# EAGLE design R131C (EAGLE 6.6.0)
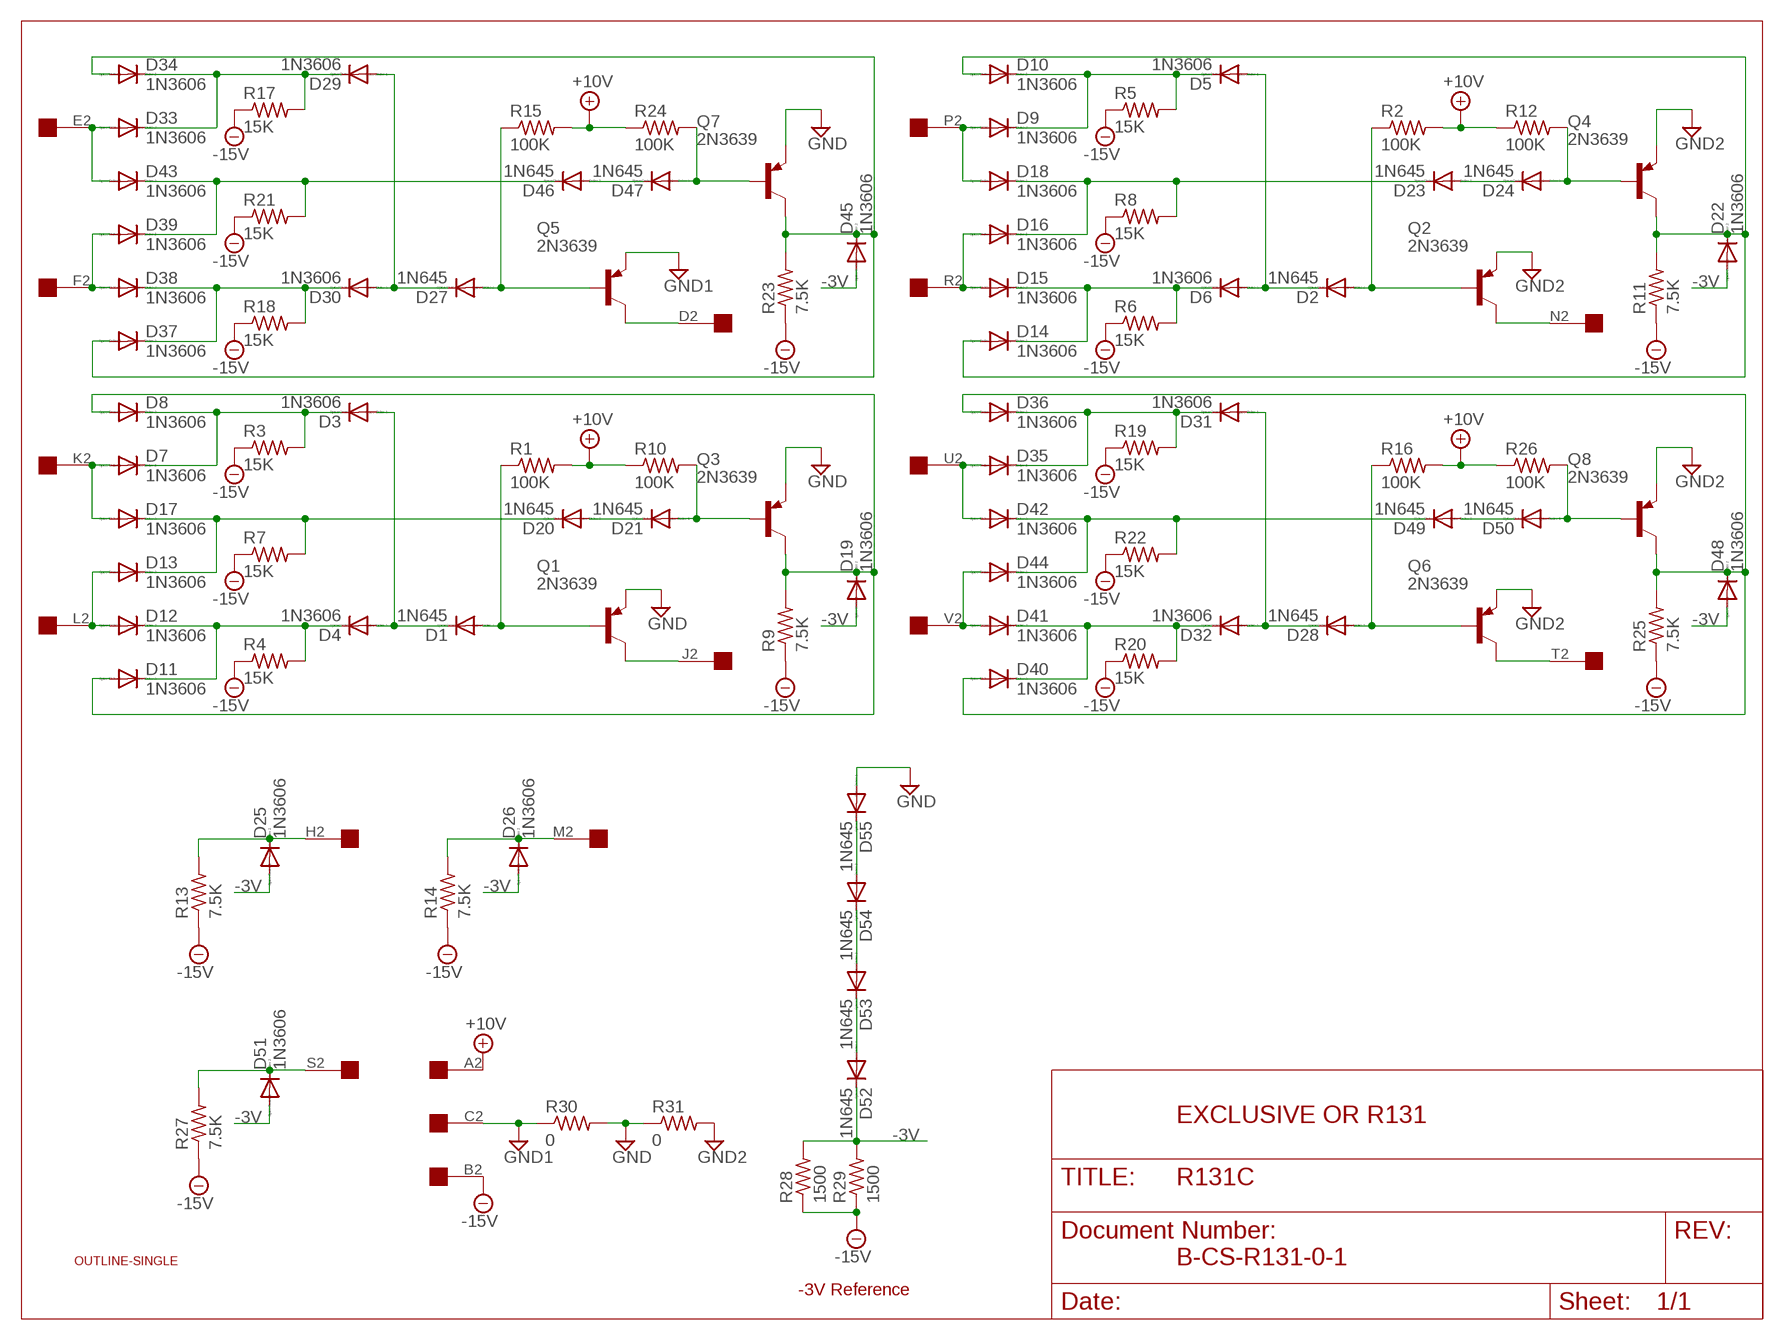
[diagram p0: schematic, sheet 1]

## Parts
D1  1N645  1N4148DO35-10  [DO35-10]
D2  1N645  1N4148DO35-10  [DO35-10]
D3  1N3606  1N4148DO35-10  [DO35-10]
D4  1N3606  1N4148DO35-10  [DO35-10]
D5  1N3606  1N4148DO35-10  [DO35-10]
D6  1N3606  1N4148DO35-10  [DO35-10]
D7  1N3606  1N4148DO35-10  [DO35-10]
D8  1N3606  1N4148DO35-10  [DO35-10]
D9  1N3606  1N4148DO35-10  [DO35-10]
D10  1N3606  1N4148DO35-10  [DO35-10]
D11  1N3606  1N4148DO35-10  [DO35-10]
D12  1N3606  1N4148DO35-10  [DO35-10]
D13  1N3606  1N4148DO35-10  [DO35-10]
D14  1N3606  1N4148DO35-10  [DO35-10]
D15  1N3606  1N4148DO35-10  [DO35-10]
D16  1N3606  1N4148DO35-10  [DO35-10]
D17  1N3606  1N4148DO35-10  [DO35-10]
D18  1N3606  1N4148DO35-10  [DO35-10]
D19  1N3606  1N4148DO35-10  [DO35-10]
D20  1N645  1N4148DO35-10  [DO35-10]
D21  1N645  1N4148DO35-10  [DO35-10]
D22  1N3606  1N4148DO35-10  [DO35-10]
D23  1N645  1N4148DO35-10  [DO35-10]
D24  1N645  1N4148DO35-10  [DO35-10]
D25  1N3606  1N4148DO35-10  [DO35-10]
D26  1N3606  1N4148DO35-10  [DO35-10]
D27  1N645  1N4148DO35-10  [DO35-10]
D28  1N645  1N4148DO35-10  [DO35-10]
D29  1N3606  1N4148DO35-10  [DO35-10]
D30  1N3606  1N4148DO35-10  [DO35-10]
D31  1N3606  1N4148DO35-10  [DO35-10]
D32  1N3606  1N4148DO35-10  [DO35-10]
D33  1N3606  1N4148DO35-10  [DO35-10]
D34  1N3606  1N4148DO35-10  [DO35-10]
D35  1N3606  1N4148DO35-10  [DO35-10]
D36  1N3606  1N4148DO35-10  [DO35-10]
D37  1N3606  1N4148DO35-10  [DO35-10]
D38  1N3606  1N4148DO35-10  [DO35-10]
D39  1N3606  1N4148DO35-10  [DO35-10]
D40  1N3606  1N4148DO35-10  [DO35-10]
D41  1N3606  1N4148DO35-10  [DO35-10]
D42  1N3606  1N4148DO35-10  [DO35-10]
D43  1N3606  1N4148DO35-10  [DO35-10]
D44  1N3606  1N4148DO35-10  [DO35-10]
D45  1N3606  1N4148DO35-10  [DO35-10]
D46  1N645  1N4148DO35-10  [DO35-10]
D47  1N645  1N4148DO35-10  [DO35-10]
D48  1N3606  1N4148DO35-10  [DO35-10]
D49  1N645  1N4148DO35-10  [DO35-10]
D50  1N645  1N4148DO35-10  [DO35-10]
D51  1N3606  1N4148DO35-10  [DO35-10]
D52  1N645  1N4148DO35-10  [DO35-10]
D53  1N645  1N4148DO35-10  [DO35-10]
D54  1N645  1N4148DO35-10  [DO35-10]
D55  1N645  1N4148DO35-10  [DO35-10]
Q1  2N3639  2N3637  [TO39]
Q2  2N3639  2N3637  [TO39]
Q3  2N3639  2N3637  [TO39]
Q4  2N3639  2N3637  [TO39]
Q5  2N3639  2N3637  [TO39]
Q6  2N3639  2N3637  [TO39]
Q7  2N3639  2N3637  [TO39]
Q8  2N3639  2N3637  [TO39]
R1  100K  R-US_0207/10  [0207/10]
R2  100K  R-US_0207/10  [0207/10]
R3  15K  R-US_0207/10  [0207/10]
R4  15K  R-US_0207/10  [0207/10]
R5  15K  R-US_0207/10  [0207/10]
R6  15K  R-US_0207/10  [0207/10]
R7  15K  R-US_0207/10  [0207/10]
R8  15K  R-US_0207/10  [0207/10]
R9  7.5K  R-US_0207/10  [0207/10]
R10  100K  R-US_0207/10  [0207/10]
R11  7.5K  R-US_0207/10  [0207/10]
R12  100K  R-US_0207/10  [0207/10]
R13  7.5K  R-US_0207/10  [0207/10]
R14  7.5K  R-US_0207/10  [0207/10]
R15  100K  R-US_0207/10  [0207/10]
R16  100K  R-US_0207/10  [0207/10]
R17  15K  R-US_0207/10  [0207/10]
R18  15K  R-US_0207/10  [0207/10]
R19  15K  R-US_0207/10  [0207/10]
R20  15K  R-US_0207/10  [0207/10]
R21  15K  R-US_0207/10  [0207/10]
R22  15K  R-US_0207/10  [0207/10]
R23  7.5K  R-US_0207/10  [0207/10]
R24  100K  R-US_0207/10  [0207/10]
R25  7.5K  R-US_0207/10  [0207/10]
R26  100K  R-US_0207/10  [0207/10]
R27  7.5K  R-US_0207/10  [0207/10]
R28  1500  R-US_0207/10  [0207/10]
R29  1500  R-US_0207/10  [0207/10]
R30  0  R-US_0207/10  [0207/10]
R31  0  R-US_0207/10  [0207/10]
U$1  OUTLINE-SINGLE  [SINGLE]
U$2  EDGE-1  [EDGE-CON1]

## Nets
+10V [Power]: R1.2 R2.2 R10.1 R12.1 R15.2 R16.2 R24.1 R26.1 U$2.A2
-3V [Power]: D19.A D22.A D25.A D26.A D45.A D48.A D51.A D52.C R28.2 R29.2
-15V [Power]: R3.1 R4.1 R5.1 R6.1 R7.1 R8.1 R9.1 R11.1 R13.1 R14.1 R17.1 R18.1 R19.1 R20.1 R21.1 R22.1 R23.1 R25.1 R27.1 R28.1 R29.1 U$2.B2
GND [Power]: D55.A Q1.1(E) Q3.1(E) Q7.1(E) R30.2 R31.1
GND1 [Power]: Q5.1(E) R30.1 U$2.C2
GND2: Q2.1(E) Q4.1(E) Q6.1(E) Q8.1(E) R31.2
N$1: D38.A D39.A U$2.F2
N$2: D4.C D11.C D12.C R4.2
N$3: D7.A D17.A U$2.K2
N$4: D29.C D33.C D34.C R17.2
N$5: D39.C D43.C D46.C R21.2
N$6: D30.C D37.C D38.C R18.2
N$7: D12.A D13.A U$2.L2
N$8: D3.C D7.C D8.C R3.2
N$9: D46.A D47.C
N$10: D13.C D17.C D20.C R7.2
N$11: D20.A D21.C
N$12: D21.A Q3.2(B) R10.2
N$13: D8.A D11.A D19.C Q3.3(C) R9.2
N$14: D1.C D3.A D4.A
N$15: D27.C D29.A D30.A
N$16: D47.A Q7.2(B) R24.2
N$17: D1.A Q1.2(B) R1.1
N$18: D34.A D37.A D45.C Q7.3(C) R23.2
N$19: Q1.3(C) U$2.J2
N$20: D33.A D43.A U$2.E2
N$21: D27.A Q5.2(B) R15.1
N$22: Q5.3(C) U$2.D2
N$23: D25.C R13.2 U$2.H2
N$24: D26.C R14.2 U$2.M2
N$25 [Power]: D52.A D53.C
N$26 [Power]: D53.A D54.C
N$27 [Power]: D54.A D55.C
N$28: D6.C D14.C D15.C R6.2
N$29: D9.A D18.A U$2.P2
N$30: D15.A D16.A U$2.R2
N$31: D5.C D9.C D10.C R5.2
N$32: D16.C D18.C D23.C R8.2
N$33: D23.A D24.C
N$34: D24.A Q4.2(B) R12.2
N$35: D10.A D14.A D22.C Q4.3(C) R11.2
N$36: D2.C D5.A D6.A
N$37: D2.A Q2.2(B) R2.1
N$38: Q2.3(C) U$2.N2
N$39: D32.C D40.C D41.C R20.2
N$40: D35.A D42.A U$2.U2
N$41: D41.A D44.A U$2.V2
N$42: D31.C D35.C D36.C R19.2
N$43: D42.C D44.C D49.C R22.2
N$44: D49.A D50.C
N$45: D50.A Q8.2(B) R26.2
N$46: D36.A D40.A D48.C Q8.3(C) R25.2
N$47: D28.C D31.A D32.A
N$48: D28.A Q6.2(B) R16.1
N$49: Q6.3(C) U$2.T2
N$50: D51.C R27.2 U$2.S2

## Notes on the sheet
- EXCLUSIVE OR R131
- B-CS-R131-0-1
- -3V Reference

## Library data of the parts
D1-D55 = diode:1N4148: DIODE high speed (Philips)
Q1-Q8 = transistor-pnp:2N3637*: PNP Transistror
R1-R31 = rcl:R-US_: RESISTOR, American symbol
U$1 = dec-con:OUTLINE-*: Board outlines for DEC boards.
U$2 = dec-con:EDGE-1: Single-Sided DEC Edge Connector -- (side 2)

## Net classes
1 Power: width 0.813 mm

## Board
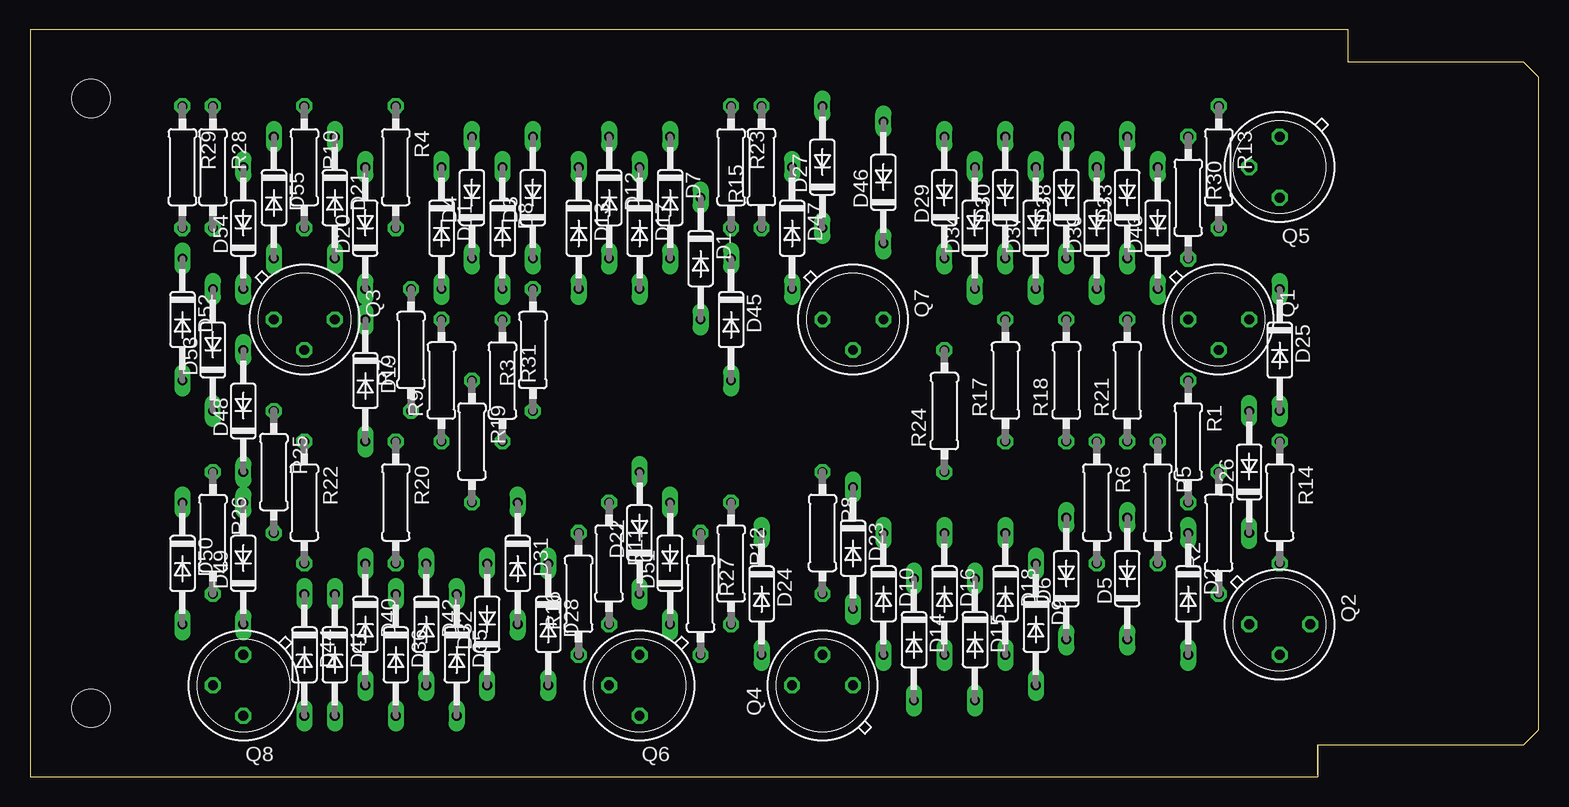
[diagram p1: board, top side]
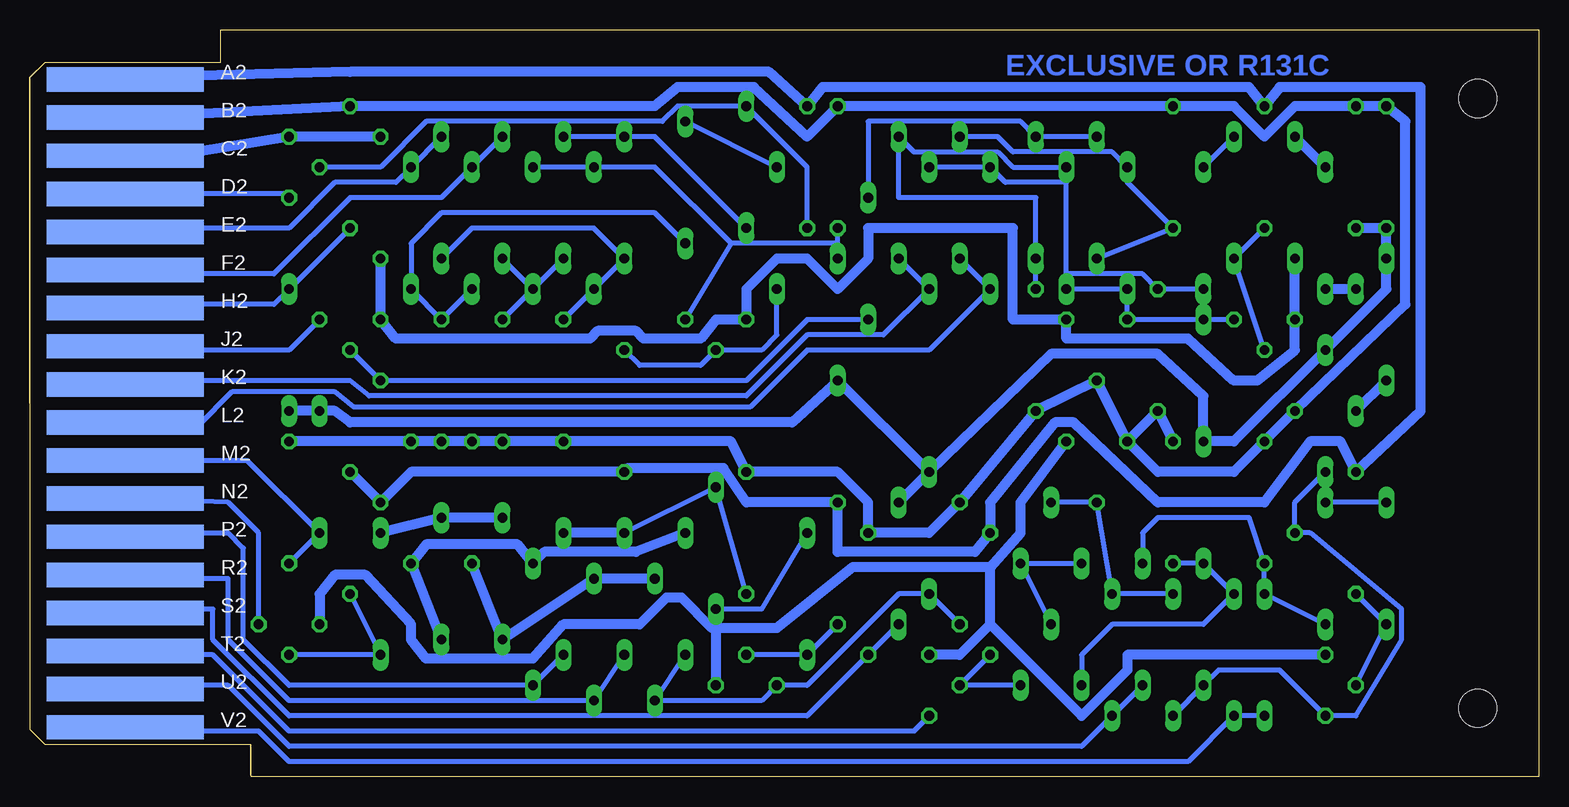
[diagram p2: board, bottom side, seen from below]

Size 125.73 x 62.23 mm. Coordinates in mm from the lower left corner, seen from the top.
Copper layers (1+16): Top 0.035mm / dielectric 1.5mm / Bottom 0.035mm
Design rules "16mils": minimum track width 16mil, minimum drill 32mil, track to track 15mil, track to pad 10mil, pad to pad 10mil, via to via 10mil, smd to smd 10mil, copper to edge 13mil, drill to drill 10mil, minimum pad ring 10mil, minimum via ring 8mil, stop-mask expansion 0mil, vias tented up to drill 0mil, thermal gap 10mil

### Footprints (pad centres in the part's own frame; a part is rotated, then mirrored left to right if it is on the bottom)
DO35-10 = drill 0.813 long: A 5.08,0; C -5.08,0
TO39 = drill 0.813 octagon: 1 0,-2.54; 2 2.54,0; 3 0,2.54
0207/10 = drill 0.813 octagon: 1 -5.08,0; 2 5.08,0
SINGLE = hole 3.175: 120.65,56.515; 120.65,5.715
EDGE-CON1 = smd 13.106 x 2.032 bottom: A2 7.938,4.128; B2 7.938,7.303; C2 7.938,10.477; D2 7.938,13.652; E2 7.938,16.828; F2 7.938,20.003; H2 7.938,23.177; J2 7.938,26.352; K2 7.938,29.527; L2 7.938,32.703; M2 7.938,35.877; N2 7.938,39.053; P2 7.938,42.227; R2 7.938,45.403; S2 7.938,48.578; T2 7.938,51.752; U2 7.938,54.928; V2 7.938,58.102

### Placement (x,y rotation side)
D1  55.88,43.18 270 top
D2  96.52,15.24 270 top
D3  41.91,48.26 90 top
D4  36.83,48.26 90 top
D5  91.44,16.51 90 top
D6  86.36,16.51 90 top
D7  53.34,48.26 270 top
D8  39.37,45.72 270 top
D9  83.82,12.7 270 top
D10  71.12,15.24 270 top
D11  34.29,45.72 270 top
D12  48.26,48.26 270 top
D13  45.72,45.72 270 top
D14  73.66,11.43 270 top
D15  78.74,11.43 270 top
D16  76.2,15.24 270 top
D17  50.8,45.72 270 top
D18  81.28,15.24 270 top
D19  27.94,33.02 270 top
D20  27.94,45.72 90 top
D21  25.4,48.26 270 top
D22  50.8,20.32 90 top
D23  68.58,19.05 270 top
D24  60.96,15.24 270 top
D25  104.14,35.56 270 top
D26  101.6,25.4 90 top
D27  66.04,50.8 90 top
D28  43.18,12.7 270 top
D29  76.2,48.26 90 top
D30  81.28,48.26 90 top
D31  40.64,17.78 270 top
D32  38.1,12.7 90 top
D33  91.44,48.26 90 top
D34  78.74,45.72 90 top
D35  35.56,10.16 270 top
D36  30.48,10.16 270 top
D37  83.82,45.72 90 top
D38  86.36,48.26 90 top
D39  88.9,45.72 90 top
D40  27.94,12.7 270 top
D41  25.4,10.16 270 top
D42  33.02,12.7 270 top
D43  93.98,45.72 90 top
D44  22.86,10.16 270 top
D45  58.42,38.1 270 top
D46  71.12,49.53 90 top
D47  63.5,45.72 270 top
D48  17.78,30.48 90 top
D49  17.78,17.78 90 top
D50  12.7,17.78 270 top
D51  53.34,17.78 90 top
D52  12.7,38.1 270 top
D53  15.24,35.56 90 top
D54  17.78,45.72 90 top
D55  20.32,48.26 270 top
Q1  99.06,38.1 270 top
Q2  104.14,12.7 270 top
Q3  22.86,38.1 270 top
Q4  66.04,7.62 90 top
Q5  104.14,50.8 180 top
Q6  50.8,7.62 180 top
Q7  68.58,38.1 270 top
Q8  17.78,7.62 180 top
R1  96.52,27.94 270 top
R2  99.06,20.32 90 top
R3  41.91,35.56 90 top
R4  30.48,50.8 270 top
R5  93.98,22.86 270 top
R6  88.9,22.86 270 top
R7  31.75,35.56 90 top
R8  66.04,20.32 270 top
R9  34.29,33.02 90 top
R10  22.86,50.8 270 top
R11  48.26,17.78 270 top
R12  58.42,17.78 270 top
R13  99.06,50.8 270 top
R14  104.14,22.86 270 top
R15  60.96,50.8 90 top
R16  45.72,15.24 90 top
R17  81.28,33.02 90 top
R18  86.36,33.02 90 top
R19  36.83,27.94 270 top
R20  30.48,22.86 270 top
R21  91.44,33.02 90 top
R22  22.86,22.86 270 top
R23  58.42,50.8 270 top
R24  76.2,30.48 90 top
R25  20.32,25.4 270 top
R26  15.24,20.32 270 top
R27  55.88,15.24 270 top
R28  15.24,50.8 270 top
R29  12.7,50.8 270 top
R30  96.52,48.26 270 top
R31  39.37,33.02 270 top
U$1  125.73,62.23 180 top
U$2  125.73,62.23 180 top

### Tracks (layer width: path | path; a pad name or v marks a point on that pad's centre or on a via)
+10V
  Bottom 0.813: U$2.A2 111.76,58.42 99.06,58.74 64.14,58.74 R15.2 59.69,57.47 24.13,57.47 R10.1 21.59,57.47 9.84,57.47 9.84,30.48 R26.1 16.51,27.94 19.05,27.94 22.86,22.86 31.75,22.86 38.73,29.53 40.32,29.53 45.72,22.86 R16.2 46.99,18.73 58.42,18.73 R12.1 66.04,22.86 67.94,25.72 75.88,25.72 R24.1 93.98,25.4 R1.2 R2.2
-3V
  Bottom 0.813: D25.A D26.A 100.33,30.48 99.06,29.53 62.23,29.53 D45.A D22.A | D22.A D51.A | R28.2 R29.2 D52.C 12.7,40.64 D48.A 25.4,27.94 D19.A 27.94,31.75 31.75,35.24 40.64,35.24 D22.A
-15V
  Bottom 0.813: U$2.B2 R13.1 73.66,55.88 71.75,57.47 65.41,57.47 60.96,53.34 R23.1 R4.1 25.4,55.88 22.86,53.34 20.32,55.88 R28.1 R29.1 11.11,54.61 11.11,39.37 R25.1 R22.1 25.4,25.4 31.75,25.4 R9.1 | R14.1 R5.1 R21.1 R6.1 R18.1 R17.1 67.31,27.94 R8.1 58.42,25.4 55.88,22.86 R27.1 50.8,20.32 R11.1 R3.1 R19.1 R9.1 | R9.1 R7.1 R20.1
GND
  Bottom 0.813: R30.2 Q1.1 95.25,36.51 79.06,36.51 78.42,37.15 75.25,37.15 74.61,36.51 69.85,36.51 68.58,38.1 Q7.1 66.04,40.64 63.5,43.18 60.96,43.18 58.42,40.64 55.88,43.18 55.88,45.72 43.81,45.72 43.81,38.1 R31.1 39.37,36.51 29.21,36.51 25.4,33.02 23.5,33.02 20.32,35.56 Q3.1 D55.A
GND1
  Bottom 0.813: U$2.C2 111.76,52.07 Q5.1 R30.1
GND2
  Bottom 0.813: Q8.1 34.29,10.16 34.29,8.89 38.1,5.08 45.72,12.7 | 45.72,12.7 48.26,10.16 Q6.1 | 45.72,12.7 45.72,17.46 | 45.72,17.46 43.18,20.32 43.18,22.86 R31.2 | 68.58,12.38 Q4.1 | 68.58,12.38 63.5,12.38 57.15,17.46 45.72,17.46 | 68.58,12.38 68.9,12.38 71.44,14.92 72.71,14.92 74.93,12.7 81.28,12.7 83.82,9.84 92.71,9.84 93.98,11.43 93.98,12.7 97.79,16.83 100.33,16.83 101.6,15.24 Q2.1
N$1
  Bottom 0.406: D38.A D39.A 91.44,48.26 99.06,48.26 105.41,41.91 111.76,41.91 112.04,42.19 U$2.F2
N$2
  Bottom 0.406: D4.C R4.2 34.29,49.53 D11.C 35.56,52.07 43.81,52.07 45.09,53.34 D12.C
N$3
  Bottom 0.406: D7.A D17.A 54.61,36.83 60.96,36.83 66.04,31.75 97.47,31.75 99.06,33.02 116.84,33.02 117.14,32.72 U$2.K2
N$4
  Bottom 0.406: R17.2 D34.C D29.C 78.74,45.72 88.9,45.72 D33.C
N$5
  Bottom 0.406: D39.C R21.2 D43.C 93.98,44.45 91.44,46.99 73.66,46.99 D46.C
N$6
  Bottom 0.406: D37.C D30.C | D37.C R18.2 | D37.C D38.C
N$7
  Bottom 0.406: D12.A D13.A 50.8,35.56 60.96,35.56 65.72,30.8 98.74,30.8 100.33,32.07 108.9,32.07 111.76,29.21 116.84,29.21 117.17,29.54 U$2.L2
N$8
  Bottom 0.406: R3.2 D3.C 41.91,48.26 53.34,48.26 D7.C 52.07,52.07 45.09,52.07 43.81,50.8 D8.C
N$9
  Bottom 0.406: D47.C D46.A
N$10
  Bottom 0.406: D20.C R7.2 33.02,41.91 39.37,41.91 39.37,49.53 44.45,49.53 D13.C D17.C
N$11
  Bottom 0.406: D21.C D20.A
N$12
  Bottom 0.406: R10.2 D21.A Q3.2
N$13
  Bottom 0.406: Q3.3 D19.C R9.2 D11.A D8.A
N$14
  Bottom 0.406: D1.C 55.88,54.61 43.18,54.61 D3.A D4.A
N$15
  Bottom 0.406: D30.A D29.A 73.66,53.34 D27.C
N$16
  Bottom 0.406: R24.2 74.93,34.29 69.85,34.29 Q7.2 64.77,35.56 63.5,36.83 D47.A
N$17
  Bottom 0.406: Q1.2 R1.1 66.04,33.02 60.96,38.1 D1.A
N$18
  Bottom 0.406: R23.2 D45.C 58.42,44.45 67.31,44.45 | 67.31,44.45 Q7.3 | D37.A D34.A 73.66,50.8 67.31,44.45
N$19
  Bottom 0.406: U$2.J2 112.09,35.89 111.76,35.56 104.14,35.56 Q1.3
N$20
  Bottom 0.406: D33.A D43.A 95.25,49.53 100.33,49.53 104.14,45.72 111.76,45.72 112.09,45.39 U$2.E2
N$21
  Bottom 0.406: Q5.2 96.52,50.8 92.71,54.61 73.03,54.61 71.75,55.88 D27.A 60.96,50.8 R15.1
N$22
  Bottom 0.406: U$2.D2 104.44,48.56 Q5.3
N$23
  Bottom 0.406: U$2.H2 117.76,39.37 105.41,39.37 D25.C R13.2
N$24
  Bottom 0.406: U$2.M2 107.62,26.34 D26.C R14.2
N$25
  Bottom 0.813: D53.C D52.A
N$26
  Bottom 0.813: D53.A D54.C
N$27
  Bottom 0.813: D54.A D55.C
N$28
  Bottom 0.813: R6.2 D6.C D15.C D14.C
N$29
  Bottom 0.406: D18.A D9.A 104.14,7.62 107.95,11.43 107.95,19.05 109.22,20.32 116.84,20.32 U$2.P2
N$30
  Bottom 0.406: U$2.R2 117.73,16.51 109.22,16.51 109.22,11.43 104.14,6.35 D15.A D16.A
N$31
  Bottom 0.813: D5.C R5.2 92.71,19.37 85.09,19.37 D9.C 82.87,18.73 75.25,18.73 D10.C
N$32
  Bottom 0.406: D16.C D23.C R8.2
  Bottom 0.813: D16.C D18.C
N$33
  Bottom 0.406: D23.A 64.77,13.97 D24.C
N$34
  Bottom 0.406: Q4.2 D24.A R12.2
N$35
  Bottom 0.406: R11.2 D22.C 53.34,15.24 60.96,7.62 Q4.3 64.77,6.35 D14.A D10.A
N$36
  Bottom 0.813: D2.C D5.A D6.A
N$37
  Bottom 0.406: Q2.2 D2.A R2.1
N$38
  Bottom 0.406: U$2.N2 109.22,22.86 106.68,20.32 Q2.3
N$39
  Bottom 0.406: R20.2 D40.C D41.C 27.94,12.7 35.56,12.7 38.1,10.16 D32.C
N$40
  Bottom 0.406: U$2.U2 116.84,7.62 109.22,7.62 104.14,2.54 38.1,2.54 D35.A D42.A
N$41
  Bottom 0.406: D44.A D41.A 29.21,1.27 104.14,1.27 106.68,3.81 111.76,3.81 U$2.V2
N$42
  Bottom 0.406: D36.C D35.C R19.2 D31.C
N$43
  Bottom 0.406: D49.C D44.C R22.2 24.13,21.59 31.75,21.59 33.02,20.32 D42.C
N$44
  Bottom 0.406: D50.C D49.A
N$45
  Bottom 0.406: Q8.2 D50.A R26.2
N$46
  Bottom 0.406: D36.A D40.A 26.67,8.89 21.59,8.89 Q8.3 15.24,5.08 11.43,11.43 11.43,13.97 19.05,20.32 R25.2 20.32,22.86 D48.C
N$47
  Bottom 0.406: D32.A D28.C D31.A
N$48
  Bottom 0.406: D28.A Q6.2 R16.1
N$49
  Bottom 0.406: Q6.3 52.07,3.81 104.14,3.81 110.49,10.16 111.76,10.16 U$2.T2
N$50
  Bottom 0.406: U$2.S2 117.73,13.97 110.49,13.97 110.49,11.43 104.14,5.08 60.96,5.08 R27.2 D51.C

### Text on the board
Bottom: EXCLUSIVE OR R131C